# Altium schematic sheet TH8_TEC_driver.SchDoc: TEC
size 420 x 297 mm; Author: G.Kasprowicz; CompanyName: WUT ISE; DrawnBy: G.Kasprowicz; Organization: WUT ISE; Address1: PW ISE; Address2: Nowowiejska 15/19 00-665 Warsaw; Address3: gkasprow@gmail.com; DocumentNumber: 4; Revision: 1.0; SheetNumber: 4; SheetTotal: 9; ModifiedBy: -; CheckedDate: -; Title2: driver; DivGrp: WUT ISE; Designer: G.Kasprowicz; ModifiedDate: -; ProjectName: Sensor Box
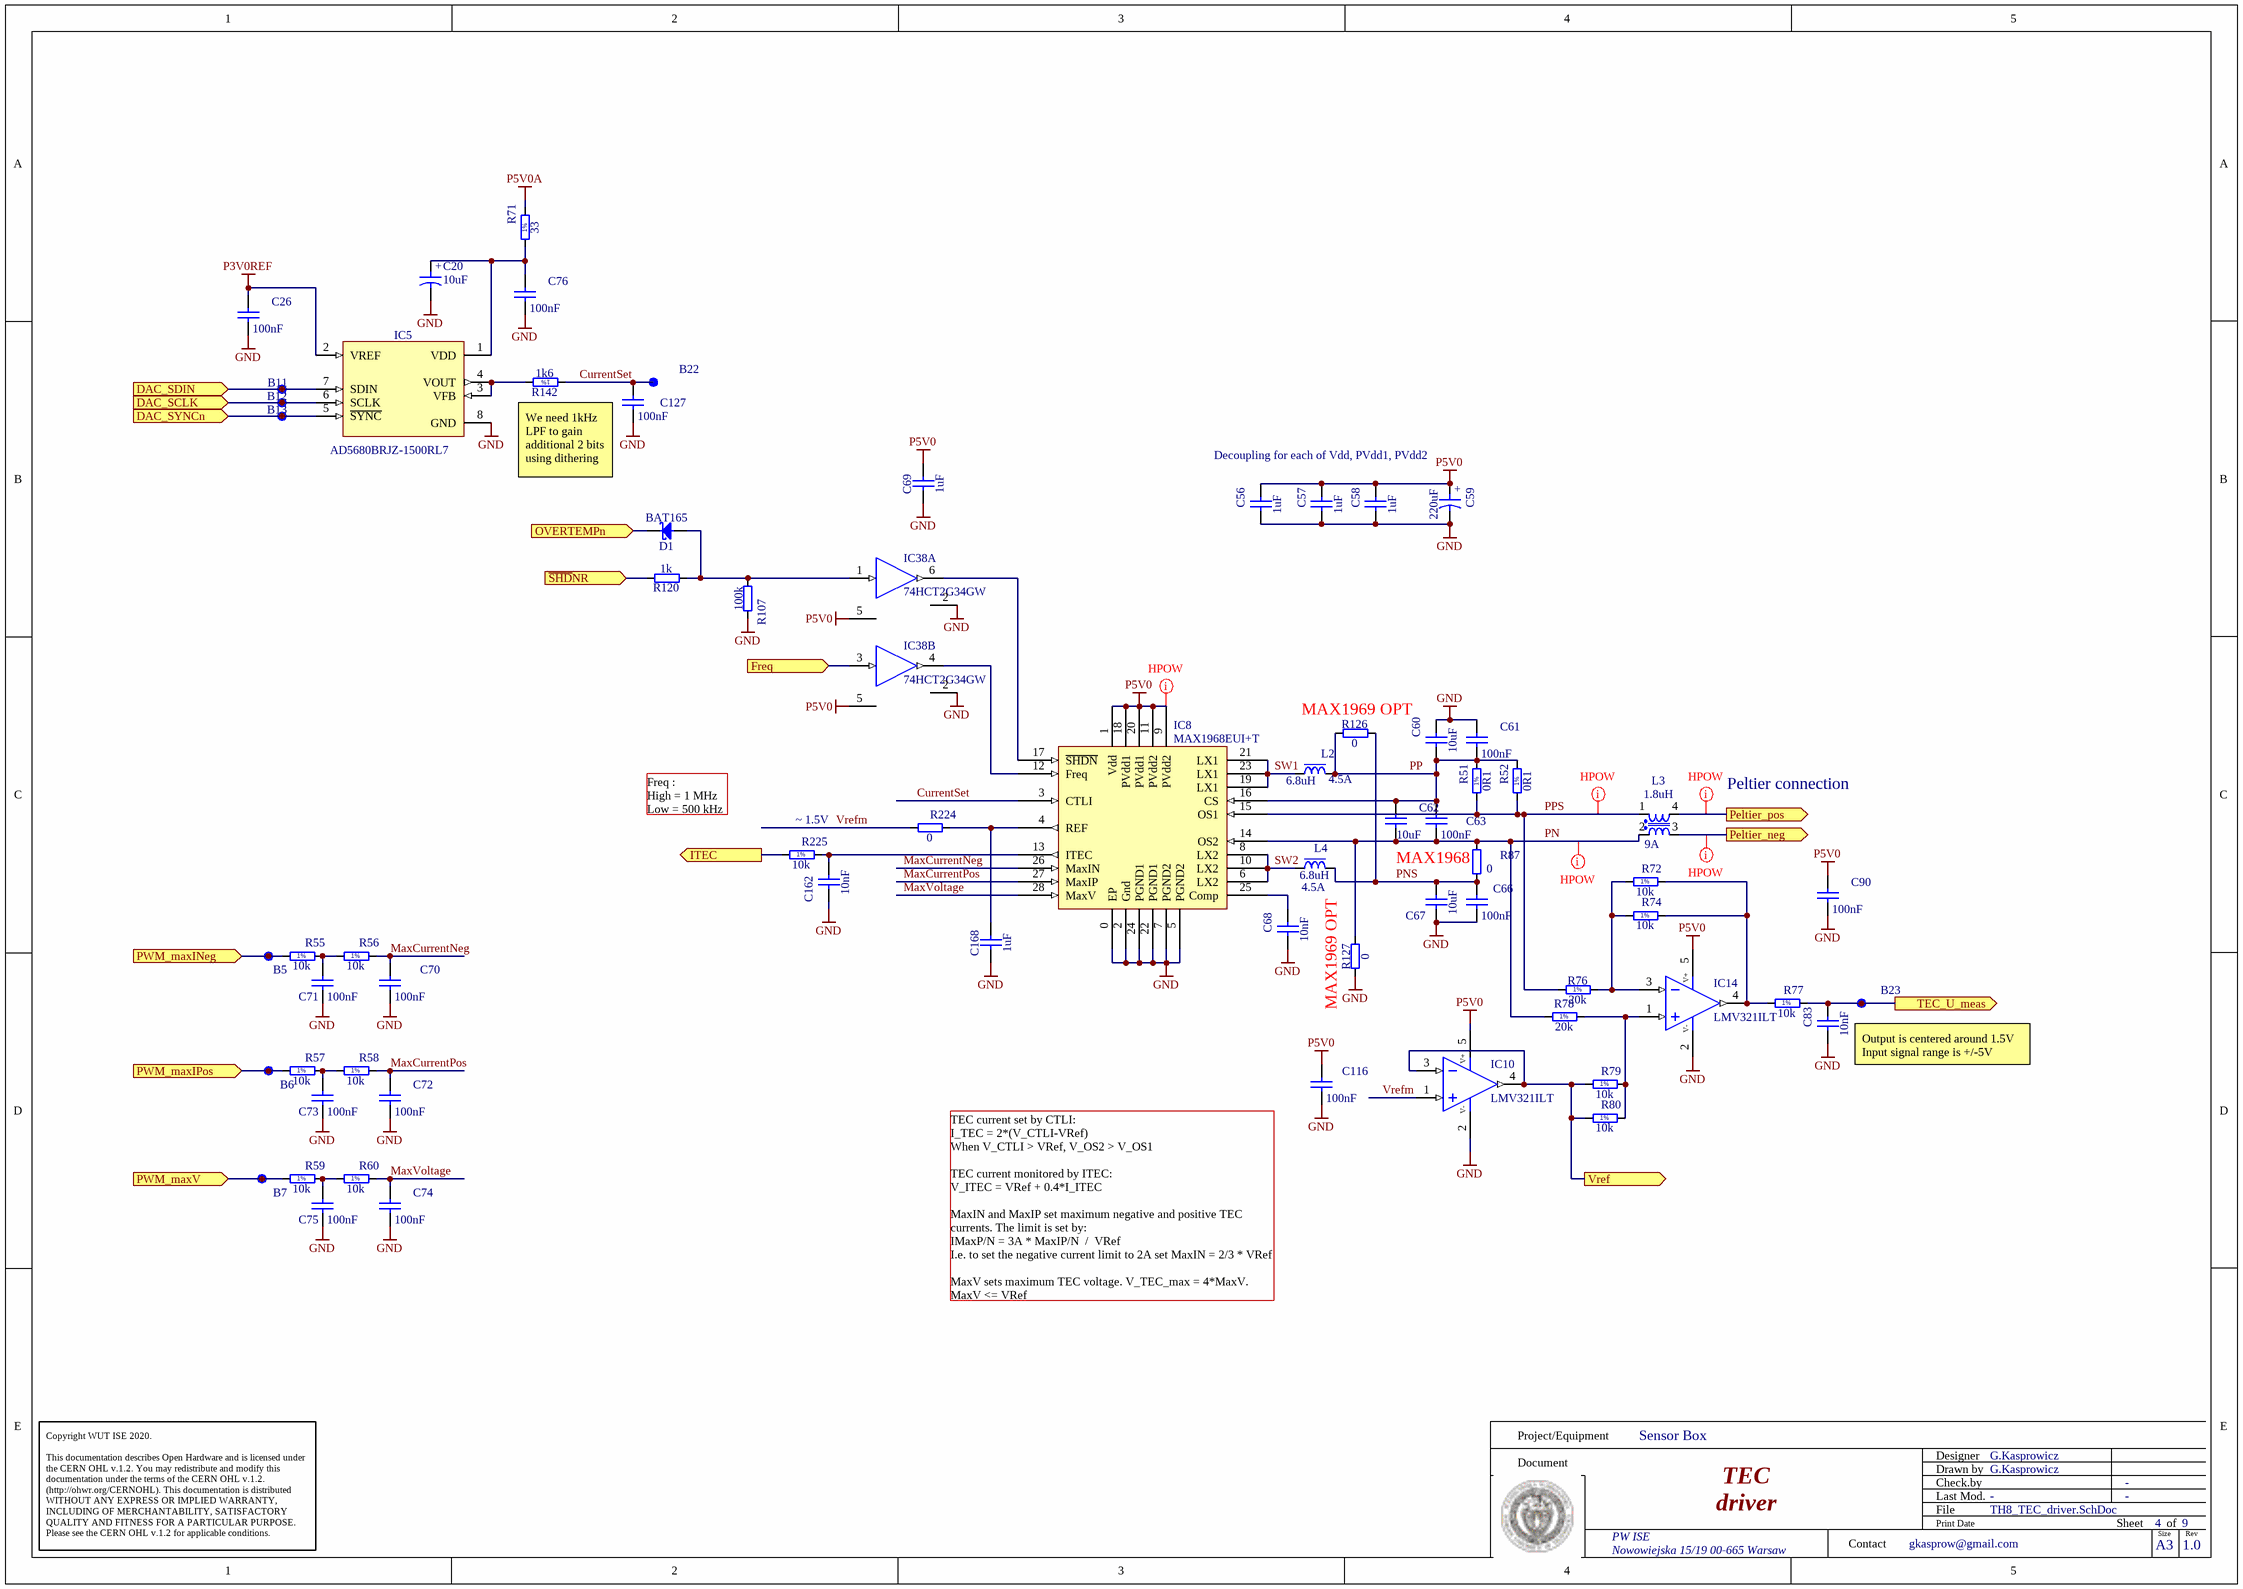
[diagram p0: TH8_TEC_driver.SchDoc]

## Parts
B5  SMD Pad  [C100]  (value not drawn)
B6  SMD Pad  [C100]  (value not drawn)
B7  SMD Pad  [C100]  (value not drawn)
B11  SMD Pad  [C100]  (value not drawn)
B12  SMD Pad  [C100]  (value not drawn)
B13  SMD Pad  [C100]  (value not drawn)
B22  SMD Pad  [C100]  (value not drawn)
B23  SMD Pad  [C100]  (value not drawn)
C20  10uF  [CAPMP3216X180N]
C26  100nF  [CAPC1005X55N]
C56  1uF  [CAPC1608X87N]
C57  1uF  [CAPC1608X87N]
C58  1uF  [CAPC1608X87N]
C59  220uF  [CAPMP7343X430N]
C60  10uF  [CAPC2012X135N]
C61  100nF  [CAPC1005X55N]
C62  10uF  [CAPC2012X135N]
C63  100nF  [CAPC1005X55N]
C66  100nF  [CAPC1005X55N]
C67  10uF  [CAPC2012X135N]
C68  10nF  [CAPC1005X55N]
C69  1uF  [CAPC1608X87N]
C70  100nF  [CAPC1005X55N]
C71  100nF  [CAPC1005X55N]
C72  100nF  [CAPC1005X55N]
C73  100nF  [CAPC1005X55N]
C74  100nF  [CAPC1005X55N]
C75  100nF  [CAPC1005X55N]
C76  100nF  [CAPC1005X55N]
C83  10nF  [CAPC1005X55N]
C90  100nF  [CAPC1005X55N]
C116  100nF  [CAPC1005X55N]
C127  100nF  [CAPC1005X55N]
C162  10nF  [CAPC1005X55N]
C168  1uF  [CAPC1608X87N]
D1  BAT165  [SOD2512X110N]
IC5  AD5680BRJZ-1500RL7  [SOT65P280X145-8N]
IC8  MAX1968EUI+T  [TSSOP28-EP]
IC10  LMV321ILT  [SOT95P280X145-5N]
IC14  LMV321ILT  [SOT95P280X145-5N]
IC38  74HCT2G34GW  [SOT65P210X110-6N]  (parts A,B of 2)
L2  6.8uH  Power: 4.5A  [INDM6965X300N]
L3  1.8uH  Power: 9A  [IND_PULSE_PA4339]
L4  6.8uH  Power: 4.5A  [INDM6965X300N]
R51  0R1  [RESC3216X65N]
R52  0R1  [RESC3216X65N]
R55  10k  [RESC1005X40N]
R56  10k  [RESC1005X40N]
R57  10k  [RESC1005X40N]
R58  10k  [RESC1005X40N]
R59  10k  [RESC1005X40N]
R60  10k  [RESC1005X40N]
R71  33  [RESC1005X40N]
R72  10k  [RESC1005X40N]
R74  10k  [RESC1005X40N]
R76  20k  [RESC1005X40N]
R77  10k  [RESC1005X40N]
R78  20k  [RESC1005X40N]
R79  10k  [RESC1005X40N]
R80  10k  [RESC1005X40N]
R87  0  [RESC3116X80N]
R107  100k  [RESC1005X40N]
R120  1k  [RESC1005X40N]
R126  0  [RESC3116X80N]
R127  0  [RESC3116X80N]
R142  1k6  [RESC1005X40N]
R224  0  [RESC1005X40N]
R225  10k  [RESC1005X40N]

## Ports
DAC_SCLK (in), DAC_SDIN (in), DAC_SYNCn (in), Freq (in), ITEC (out), OVERTEMPn (in), Peltier_neg (out), Peltier_pos (out), PWM_maxINeg (in), PWM_maxIPos (in), PWM_maxV (in), TEC_U_meas (out), Vref (out), ~{SHD}NR (in)

## Nets
GND: C20.2 C26.2 C56.1 C57.1 C58.1 C59.2 C60.2 C61.1 C66.2 C67.1 C68.1 C69.1 C70.2 C71.2 C72.2 C73.2 C74.2 C75.2 C76.2 C83.1 C90.2 C116.2 C127.2 C162.1 C168.1 IC5.8(GND) IC8.0(EP) IC8.2(Gnd) IC8.5(PGND2) IC8.7(PGND2) IC8.22(PGND1) IC8.24(PGND1) IC10.2(V-) IC14.2(V-) IC38.2(GND) R107.2 R127.1
P3V0REF: C26.1 IC5.2(VREF)
P5V0: C56.2 C57.2 C58.2 C59.1 C69.2 C90.1 C116.1 IC8.1(Vdd) IC8.9(PVdd2) IC8.11(PVdd2) IC8.18(PVdd1) IC8.20(PVdd1) IC10.5(V+) IC14.5(V+) IC38.5(VCC)
P5V0A: R71.2
~{SHD}NR: R120.2 ; port ~{SHD}NR
CurrentSet: B22.1 C127.1 IC8.3(CTLI) R142.1
DAC_SCLK: B12.1 IC5.6(SCLK) ; port DAC_SCLK
DAC_SDIN: B11.1 IC5.7(SDIN) ; port DAC_SDIN
DAC_SYNCn: B13.1 IC5.5(~{SYNC}) ; port DAC_SYNCn
Freq: IC38.3(2A) ; port Freq
ITEC: R225.1 ; port ITEC
MaxCurrentNeg: C70.1 IC8.26(MaxIN) R56.2
MaxCurrentPos: C72.1 IC8.27(MaxIP) R58.2
MaxVoltage: C74.1 IC8.28(MaxV) R60.2
OVERTEMPn: D1.1(C) ; port OVERTEMPn
Peltier_neg: L3.3 ; port Peltier_neg
Peltier_pos: L3.4 ; port Peltier_pos
PN: C62.1 C63.2 IC8.14(OS2) L3.2 R78.1 R87.2 R127.2
PNS: C66.1 C67.2 L4.2 R87.1 R126.2
PP: C60.1 C61.2 C62.2 C63.1 IC8.16(CS) L2.2 R51.2 R52.2 R126.1
PPS: IC8.15(OS1) L3.1 R51.1 R52.1 R76.1
PWM_maxINeg: B5.1 R55.1 ; port PWM_maxINeg
PWM_maxIPos: B6.1 R57.1 ; port PWM_maxIPos
PWM_maxV: B7.1 R59.1 ; port PWM_maxV
SW1: IC8.19(LX1) IC8.21(LX1) IC8.23(LX1) L2.1
SW2: IC8.6(LX2) IC8.8(LX2) IC8.10(LX2) L4.1
TEC_U_meas: B23.1 C83.2 R77.2 ; port TEC_U_meas
Vref: IC10.3(IN-) IC10.4(OUT) R79.1 R80.1 ; port Vref
Vrefm: IC10.1(IN+) R224.1
NetC20_1: C20.1 C76.1 IC5.1(VDD) R71.1
NetC68_2: C68.2 IC8.25(Comp)
NetC71_1: C71.1 R55.2 R56.1
NetC73_1: C73.1 R57.2 R58.1
NetC75_1: C75.1 R59.2 R60.1
NetC162_2: C162.2 IC8.13(ITEC) R225.2
NetC168_2: C168.2 IC8.4(REF) R224.2
NetD1_2: D1.2(A) IC38.1(1A) R107.1 R120.1
NetIC5_3: IC5.3(VFB) IC5.4(VOUT) R142.2
NetIC8_12: IC8.12(Freq) IC38.4(2Y)
NetIC8_17: IC8.17(~{SHDN}) IC38.6(1Y)
NetIC14_1: IC14.1(IN+) R78.2 R79.2 R80.2
NetIC14_3: IC14.3(IN-) R72.1 R74.1 R76.2
NetIC14_4: IC14.4(OUT) R72.2 R74.2 R77.1

## Layout directives
net class HPOW: P5V0, Peltier_neg, Peltier_pos, PN, PPS

## Notes on the sheet
- Decoupling for each of Vdd, PVdd1, PVdd2
- We need 1kHz LPF to gain additional 2 bits using dithering
- (near R126) MAX1969 OPT
- Peltier connection
- Freq :
  High = 1 MHz
  Low = 500 kHz
- (near R225) ~ 1.5V
- MAX1968
- (near R127) MAX1969 OPT
- Output is centered around 1.5V
  Input signal range is +/-5V
- (near C116) TEC current set by CTLI:
  I_TEC = 2*(V_CTLI-VRef)
  When V_CTLI > VRef, V_OS2 > V_OS1
  TEC current monitored by ITEC:
  V_ITEC = VRef + 0.4*I_ITEC
  MaxIN and MaxIP set maximum negative and positive TEC currents. The limit is set by:
  IMaxP/N = 3A * MaxIP/N  /  VRef
  I.e. to set the negative current limit to 2A set MaxIN = 2/3 * VRef
  MaxV sets maximum TEC voltage. V_TEC_max = 4*MaxV. MaxV <= VRef
- Project/Equipment
- Document
- Designer
- Drawn by
- Check.by
- Copyright WUT ISE 2020.
  This documentation describes Open Hardware and is licensed under the CERN OHL v.1.2. You may redistribute and modify this documentation under the terms of the CERN OHL v.1.2. (http://ohwr.org/CERNOHL). This documentation is distributed WITHOUT ANY EXPRESS OR IMPLIED WARRANTY, INCLUDING OF MERCHANTABILITY, SATISFACTORY QUALITY AND FITNESS FOR A PARTICULAR PURPOSE. Please see the CERN OHL v.1.2 for applicable conditions.
- Contact
- File
- Last Mod.
- Print Date
- Sheet
- Size
- A3
- of
- Rev
- (in symbol CTE3216-18_10UF_16V_20%_AVX_TCJ) +
- (in symbol CTE7343-43_220UF_16V_10%) +
- (in symbol R0402_1K6_1%_0.0625W_100PPM) 1%
- (in symbol R0402_10K_1%_0.0625W_100PPM) 1%
- (in symbol R0402_20K_1%_0.0625W_100PPM) 1%
- (in symbol R0402_33R_1%_0.0625W_100PPM) 1%
- (in symbol R1206_0R1_1%_0.25W_100PPM_YAGEO_PT) 1%

## Library data of the parts
B5-B7 B11-B13 B22 B23 = SMD_PAD_D1MM: Through Hole Pad; Part Description: 1mm Diameter SMD Pad; Mounted: No; Part Number: SMD_PAD_D1MM; Component Kind: Standard (No BOM); Component Type: Standard (No BOM); Pin Count: 1; Family: SMD Pad; Socket: No; SMD: No; Sense: No; Status: None; ComponentHeight: 0mm; HelpURL: Undefined; Author: CERN DEM JLC; CreateDate: 10.10.2017; LatestRevisionDate: 10.10.2017; PackageDescription: 1mm Diameter SMD Pad
C20 = CTE3216-18_10UF_16V_20%_AVX_TCJ: Polarised capacitor; Part Description: ESR 0R200 Tantalum Solid Electrolytic Chip Capacitor with Conductive Polymer Electrode; Manufacturer: AVX; Manufacturer Part Number: TCJA106M016R0200; Voltage: 16V; Tolerance: ±20%; Part Number: CTE3216-18_10UF_16V_20%_AVX_TCJ; Component Kind: Standard; Component Type: Standard; Pin Count: 2; Value: 10uF; Status: Preferred; Case: A; Mounted: Yes; Socket: No; SMD: Yes; Sense: No; ComponentHeight: 1.8mm; HelpURL: \\cern.ch\dfs\Applications\Altium\Datasheets\CTE_AVX_TCJ.pdf; Author: CERN DEM JLC; CreateDate: 29.03.2012; LatestRevisionDate: 29.03.2012
C26 C61 C63 C66 C70-C76 C90 C116 C127 = CC0402_100NF_16V_10%_X5R: Non-polarised capacitor; Part Description: SMD Multilayer Chip Ceramic Capacitor; Manufacturer: GENERIC; Manufacturer1 Part Number: GRM155R61C104KA88D; Voltage: 16V; TC: X5R; Tolerance: ±10%; Table: Capacitors SMD; Part Number: CC0402_100NF_16V_10%_X5R; Component Kind: Standard; Component Type: Standard; Pin Count: 2; Value: 100nF; Status: None; Manufacturer Part Number: CC0402_100NF_16V_10%_X5R; Case: 0402; Mounted: Yes; Socket: No; SMD: Yes; Manufacturer1 Example: MURATA; Manufacturer1 ComponentHeight: 0.55mm; HelpURL: \\cern.ch\dfs\Applications\Altium\Datasheets\CC0402_X5R_MURATA_GRM.pdf; Author: CERN DEM JLC; CreateDate: 2013-12-10; LatestRevisionDate: 2013-12-10
C56-C58 C69 C168 = CC0603_1UF_25V_10%_X7R: Non-polarised capacitor; Part Description: SMD Multilayer Chip Ceramic Capacitor; Manufacturer: GENERIC; Manufacturer1 Part Number: GRM188R71E105KA12D; Voltage: 25V; TC: X7R; Tolerance: ±10%; Part Number: CC0603_1UF_25V_10%_X7R; Component Kind: Standard; Component Type: Standard; Pin Count: 2; Value: 1uF; Status: None; Manufacturer Part Number: CC0603_1UF_25V_10%_X7R; Case: 0603; Mounted: Yes; Socket: No; SMD: Yes; Sense: No; Manufacturer1 Example: MURATA; Manufacturer1 ComponentHeight: 0.9mm; HelpURL: \\cern.ch\dfs\Applications\Altium\Datasheets\CC0603_X7R_MURATA.pdf; Author: CERN DEM JLC; CreateDate: 18/01/2011; LatestRevisionDate: 18/01/2011
C59 = CTE7343-43_220UF_16V_10%: Polarised capacitor; Part Description: Solid Tantalum Chip Capacitor; Manufacturer: GENERIC; Manufacturer1 Part Number: TAJE227K016R; Voltage: 16V; Tolerance: ±10%; Part Number: CTE7343-43_220UF_16V_10%; Component Kind: Standard; Component Type: Standard; Pin Count: 2; Value: 220uF; Status: Preferred; Manufacturer Part Number: CTE7343-43_220UF_16V_10%; Case: E; Mounted: Yes; Socket: No; SMD: Yes; Sense: No; Manufacturer1 Example: AVX; Manufacturer1 ComponentHeight: 4.3mm; HelpURL: \\cern.ch\dfs\Applications\Altium\Datasheets\CTE_AVX_TAJ.pdf; Author: CERN DEM JLC; CreateDate: 03.12.2007; LatestRevisionDate: 03.12.2007
C60 C62 C67 = CC0805_10UF_16V_10%_X5R: Non-polarised capacitor; Part Description: SMD Multilayer Chip Ceramic Capacitor; Manufacturer: GENERIC; Manufacturer1 Part Number: C0805C106K4PAC; Voltage: 16V; TC: X5R; Tolerance: ±10%; Part Number: CC0805_10UF_16V_10%_X5R; Component Kind: Standard; Component Type: Standard; Pin Count: 2; Value: 10uF; Status: Preferred; Manufacturer Part Number: CC0805_10UF_16V_10%_X5R; Case: 0805; Mounted: Yes; Socket: No; SMD: Yes; Manufacturer1 Example: KEMET; Manufacturer1 ComponentHeight: 1.4mm; HelpURL: \\cern.ch\dfs\Applications\Altium\Datasheets\CC1206_X5R_KEMET.pdf; Author: CERN DEM JLC; CreateDate: 03.12.2007; LatestRevisionDate: 03.12.2007; Sense: No
C68 C83 C162 = CC0402_10NF_25V_10%_X7R: Non-polarised capacitor; Part Description: SMD Multilayer Chip Ceramic Capacitor; Manufacturer: GENERIC; Manufacturer1 Part Number: C1005X7R1E103KT; Voltage: 25V; TC: X7R; Tolerance: ±10%; Part Number: CC0402_10NF_25V_10%_X7R; Component Kind: Standard; Component Type: Standard; Pin Count: 2; Value: 10nF; Status: Preferred; Manufacturer Part Number: CC0402_10NF_25V_10%_X7R; Case: 0402; Mounted: Yes; Socket: No; SMD: Yes; Sense: No; Manufacturer1 Example: TDK; Manufacturer1 ComponentHeight: 0.55mm; HelpURL: \\cern.ch\dfs\Applications\Altium\Datasheets\CC0402_X7R_TDK_C.pdf; Author: CERN DEM JLC; CreateDate: 25/10/2012; LatestRevisionDate: 25/10/2012
D1 = BAT165: Schottky Diode; Part Description: Medium Power AF Schottky Diode; Manufacturer: INFINEON; Voltage: 40V; Power: 750mA; PressFit: No; Bonding: No; Part Number: BAT165; Component Kind: Standard; Component Type: Standard; Device: BAT165; PackageDescription: Small Outline Diode Flat Lead (SOD-323), 1.70mm W X 1.25mm L X 1.10mm H body,  IPC Medium Density; Manufacturer Part Number: BAT165; Pin Count: 2; Case: SOD323; Mounted: Yes; Socket: No; SMD: Yes; Sense: No; ComponentHeight: 1.1mm; HelpURL: \\cern.ch\dfs\Applications\Altium\Datasheets\BAT165.pdf; Author: CERN DEM JLC; CreateDate: 12.11.2014; LatestRevisionDate: 12.11.2014
IC5 = DAC_AD5680BRJZ: 5V 18-Bit nanoDAC®in a SOT-23; Manufacturer: ANALOG DEVICES; PressFit: No; Bonding: No; Part Number: AD5680BRJZ-1500RL7; Component Kind: Standard; Component Type: Standard; Device: AD5680BRJZ-1500RL7; Footprint: TSOP65P280X145-8N; PackageDescription: TSOP, 8-Leads, Body 2,90x1,60mm, Pitch 0,65mm, IPC Medium Density; Part Description: 5V 18-Bit nanoDAC®in a SOT-23; Manufacturer Part Number: AD5680BRJZ-1500RL7; Pin Count: 17; Case: SOT-23-8; Mounted: Yes; Socket: No; SMD: Yes; Sense: No; ComponentHeight: 0.8mm; Author: GK; HelpURL: \\cern.ch\dfs\Applications\Altium\Datasheets\AD5686BCPZ.pdf; CreateDate: 21.08.2017; LatestRevisionDate: 21.08.2017
IC8 = DRV_MAX1968: Power peltier driver. bipolar; LatestRevisionDate: 17-Jul-2002; LatestRevisionNote: Re-released for DXP Platform.; Publisher: Altium Limited; Supplier 1: RS; Supplier Part Number 1: 7328863; Supplier Currency 1: GBP; Supplier Unit Price 1: 14.75
IC10 IC14 = LMV321ILT: Operational Amplifier; Part Description: Low Cost, Low Power, Input/Output Rail-To-Rail Operational Amplifiers; Manufacturer: ST MICROELECTRONICS; PressFit: No; Bonding: No; Part Number: LMV321ILT; Component Kind: Standard; Component Type: Standard; Device: LMV321ILT; PackageDescription: SOT, 0.95mm pitch; 5 pin, 1.60mm W X 2.90mm L X 1.45mm H body, IPC Medium Density; Manufacturer Part Number: LMV321ILT; Pin Count: 5; Case: SOT23-5; Mounted: Yes; Socket: No; SMD: Yes; Sense: No; ComponentHeight: 1.45mm; Author: CERN DEM MR; HelpURL: \\cern.ch\dfs\Applications\Altium\Datasheets\LMV321ILT.pdf; CreateDate: 02.10.2017; LatestRevisionDate: 02.10.2017
IC38 = 74HCT2G34GW: Dual Buffer Gate; Manufacturer: TEXAS INSTRUMENTS; PressFit: No; Bonding: No; Part Number: 74HCT2G34GW; Component Kind: Standard; Component Type: Standard; Device: 74HCT2G34GW; PackageDescription: SOT, 0.65mm Pitch; 6 Pin, 1.60mm W X 3.00mm L X 1.45mm H body, IPC Medium Density; Part Description: Dual Buffer Gate; Manufacturer Part Number: 74HCT2G34GW; Pin Count: 6; Case: SOT353; Mounted: Yes; Socket: No; SMD: Yes; Sense: No; ComponentHeight: 1.45mm; Author: GK; HelpURL: \\cern.ch\dfs\Applications\Altium\Datasheets\SN74LVC2G34DBV.pdf; CreateDate: 09.10.2020; LatestRevisionDate: 09.10.2020
L2 L4 = IND2525_6.8UH_20%_VISHAY_IHLP-2525CZ-01: Inductor With Core; Part Description: Low Profile, High Current IHLP® Inductor; Manufacturer: VISHAY DALE; Manufacturer Part Number: IHLP2525CZER6R8M01; Resistance: 0.054R; Tolerance: ±20%; Part Number: IND2525_6.8UH_20%_VISHAY_IHLP-2525CZ-01; Component Kind: Standard; Component Type: Standard; Pin Count: 2; Value: 6.8uH; Status: None; Case: 2525; Mounted: Yes; Socket: No; SMD: Yes; Sense: No; ComponentHeight: 3mm; HelpURL: \\cern.ch\dfs\Applications\Altium\Datasheets\IND2525_VISHAY_IHLP-2525CZ-01.pdf; Author: CERN DEM MR; CreateDate: 29/06/2017; LatestRevisionDate: 29/06/2017
L3 = L_CMC_PA4339.101NLT: 1.8uH 9A 10mR CMC; Part Description: Line Filter, Common Mode Choke; Manufacturer: PULSE; Resistance: 0.010R; Tolerance: ±50%; Part Number: PA4339.101NLT; Component Kind: Standard; Component Type: Standard; Pin Count: 4; Value: 1.8uH; Status: None; Manufacturer Part Number: PA4339.101NLT; Mounted: Yes; Socket: No; SMD: Yes; Sense: No; ComponentHeight: 3.8; HelpURL: \\cern.ch\dfs\Applications\Altium\Datasheets\IND_BOURNS_SRF0504.pdf; Author: GK; CreateDate: 07/08/2017; LatestRevisionDate: 07/08/2017
R51 R52 = R1206_0R1_1%_0.25W_100PPM_YAGEO_PT: Resistor - 1%; Part Description: Current Sensor, Low TCR Chip Resistor; Manufacturer: YAGEO PHYCOMP; Manufacturer Part Number: PT1206FR-070R1L; Power: 0.25W; TC: ±100ppm/°C; PressFit: No; Part Number: R1206_0R1_1%_0.25W_100PPM_YAGEO_PT; Component Kind: Standard; Component Type: Standard; Pin Count: 2; Value: 0R1; Status: None; Tolerance: ±1%; Case: 1206; Mounted: Yes; Sense: No; Socket: No; SMD: Yes; ComponentHeight: 0.65mm; HelpURL: \\cern.ch\dfs\Applications\Altium\Datasheets\R1206_YAGEO_PT.pdf; Author: CERN DEM JMW; CreateDate: 06/07/2015; LatestRevisionDate: 06/07/2015
R55-R60 R72 R74 R77 R79 R80 R225 = R0402_10K_1%_0.0625W_100PPM: Resistor - 1%; Part Description: General Purpose Thick Film Chip Resistor; Manufacturer: GENERIC; Manufacturer1 Part Number: 232270671003L; TC: ±100ppm/°C; PressFit: No; Part Number: R0402_10K_1%_0.0625W_100PPM; Component Kind: Standard; Component Type: Standard; Pin Count: 2; Value: 10k; Status: Not Recommended; Power: 0.0625W; Tolerance: ±1%; Manufacturer Part Number: R0402_10K_1%_0.0625W_100PPM; Case: 0402; Mounted: Yes; Sense: No; Socket: No; SMD: Yes; Manufacturer1 Example: YAGEO PHYCOMP; Manufacturer1 ComponentHeight: 0.4mm; HelpURL: \\cern.ch\dfs\Applications\Altium\Datasheets\R0402_Phycomp_RC0402.pdf; Author: CERN DEM JLC; CreateDate: 03/12/2007; LatestRevisionDate: 17/10/2012
R71 = R0402_33R_1%_0.0625W_100PPM: Resistor - 1%; Part Description: General Purpose Thick Film Chip Resistor; Manufacturer: GENERIC; Manufacturer1 Part Number: 232270673309L; TC: ±100ppm/°C; PressFit: No; Part Number: R0402_33R_1%_0.0625W_100PPM; Component Kind: Standard; Component Type: Standard; Pin Count: 2; Value: 33; Status: Not Recommended; Power: 0.0625W; Tolerance: ±1%; Manufacturer Part Number: R0402_33R_1%_0.0625W_100PPM; Case: 0402; Mounted: Yes; Sense: No; Socket: No; SMD: Yes; Manufacturer1 Example: YAGEO PHYCOMP; Manufacturer1 ComponentHeight: 0.4mm; HelpURL: \\cern.ch\dfs\Applications\Altium\Datasheets\R0402_Phycomp_RC0402.pdf; Author: CERN DEM JLC; CreateDate: 03/12/2007; LatestRevisionDate: 17/10/2012
R76 R78 = R0402_20K_1%_0.0625W_100PPM: Resistor - 1%; Part Description: General Purpose Thick Film Chip Resistor; Manufacturer: GENERIC; Manufacturer1 Part Number: 232270672003L; TC: ±100ppm/°C; PressFit: No; Part Number: R0402_20K_1%_0.0625W_100PPM; Component Kind: Standard; Component Type: Standard; Pin Count: 2; Value: 20k; Status: Not Recommended; Power: 0.0625W; Tolerance: ±1%; Manufacturer Part Number: R0402_20K_1%_0.0625W_100PPM; Case: 0402; Mounted: Yes; Sense: No; Socket: No; SMD: Yes; Manufacturer1 Example: YAGEO PHYCOMP; Manufacturer1 ComponentHeight: 0.4mm; HelpURL: \\cern.ch\dfs\Applications\Altium\Datasheets\R0402_Phycomp_RC0402.pdf; Author: CERN DEM JLC; CreateDate: 03.12.2007; LatestRevisionDate: 17.10.2012
R87 R126 R127 = R1206_0R_JUMPER_SEI_HCJ: Resistor; Part Description: 38.7A (0.0005R Max DC Resistance) Zero Ohm Jumper; Manufacturer: SEI (STACKPOLE ELECTRONICS INC.); Manufacturer Part Number: HCJ1206ZT0R00; PressFit: No; Part Number: R1206_0R_JUMPER_SEI_HCJ; Component Kind: Standard; Component Type: Standard; Pin Count: 2; Value: 0; Status: Not Recommended; Case: 1206; Mounted: Yes; Sense: No; Socket: No; SMD: Yes; HelpURL: \\cern.ch\dfs\Applications\Altium\Datasheets\R1206_SEI_HCJ.pdf; Author: CERN DEM MR; CreateDate: 20.02.2018; LatestRevisionDate: 20.02.2018; ComponentHeight: 0.8mm
R107 = R0402_100K_1%_0.0625W_100PPM: Resistor - 1%; Part Description: General Purpose Thick Film Chip Resistor; Manufacturer: GENERIC; Manufacturer1 Part Number: 232270671004L; TC: ±100ppm/°C; PressFit: No; Part Number: R0402_100K_1%_0.0625W_100PPM; Component Kind: Standard; Component Type: Standard; Pin Count: 2; Value: 100k; Status: Not Recommended; Power: 0.0625W; Tolerance: ±1%; Manufacturer Part Number: R0402_100K_1%_0.0625W_100PPM; Case: 0402; Mounted: Yes; Sense: No; Socket: No; SMD: Yes; Manufacturer1 Example: YAGEO PHYCOMP; Manufacturer1 ComponentHeight: 0.4mm; HelpURL: \\cern.ch\dfs\Applications\Altium\Datasheets\R0402_Phycomp_RC0402.pdf; Author: CERN DEM JLC; CreateDate: 03.12.2007; LatestRevisionDate: 17.10.2012
R120 = R0402_1K_1%_0.0625W_100PPM: Resistor - 1%; Part Description: General Purpose Thick Film Chip Resistor; Manufacturer: GENERIC; Manufacturer1 Part Number: 232270671002L; TC: ±100ppm/°C; PressFit: No; Part Number: R0402_1K_1%_0.0625W_100PPM; Component Kind: Standard; Component Type: Standard; Pin Count: 2; Value: 1k; Status: Not Recommended; Power: 0.0625W; Tolerance: ±1%; Manufacturer Part Number: R0402_1K_1%_0.0625W_100PPM; Case: 0402; Mounted: Yes; Sense: No; Socket: No; SMD: Yes; Manufacturer1 Example: YAGEO PHYCOMP; Manufacturer1 ComponentHeight: 0.4mm; HelpURL: \\cern.ch\dfs\Applications\Altium\Datasheets\R0402_Phycomp_RC0402.pdf; Author: CERN DEM JLC; CreateDate: 03.12.2007; LatestRevisionDate: 17.10.2012
R142 = R0402_1K6_1%_0.0625W_100PPM: Resistor - 1%; Part Description: General Purpose Thick Film Chip Resistor; Manufacturer: GENERIC; Manufacturer1 Part Number: 232270671602L; TC: ±100ppm/°C; PressFit: No; Part Number: R0402_1K6_1%_0.0625W_100PPM; Component Kind: Standard; Component Type: Standard; Pin Count: 2; Value: 1k6; Status: Not Recommended; Power: 0.0625W; Tolerance: ±1%; Manufacturer Part Number: R0402_1K6_1%_0.0625W_100PPM; Case: 0402; Mounted: Yes; Sense: No; Socket: No; SMD: Yes; Manufacturer1 Example: YAGEO PHYCOMP; Manufacturer1 ComponentHeight: 0.4mm; HelpURL: \\cern.ch\dfs\Applications\Altium\Datasheets\R0402_Phycomp_RC0402.pdf; Author: CERN DEM JLC; CreateDate: 03.12.2007; LatestRevisionDate: 17.10.2012
R224 = R0402_0R_Jumper: Resistor; Part Description: 1A (0.05R Max DC Resistance) Zero Ohm Jumper; Manufacturer: GENERIC; Manufacturer1 Part Number: 232270591001L; PressFit: No; Part Number: R0402_0R_JUMPER; Component Kind: Standard; Component Type: Standard; Pin Count: 2; Value: 0; Status: Not Recommended; Manufacturer Part Number: R0402_0R_JUMPER; Case: 0402; Mounted: Yes; Sense: No; Socket: No; SMD: Yes; Manufacturer1 Example: YAGEO PHYCOMP; Manufacturer1 ComponentHeight: 0.4mm; HelpURL: \\cern.ch\dfs\Applications\Altium\Datasheets\R0402_Phycomp_RC0402.pdf; Author: CERN DEM JLC; CreateDate: 03.12.2007; LatestRevisionDate: 17.10.2012